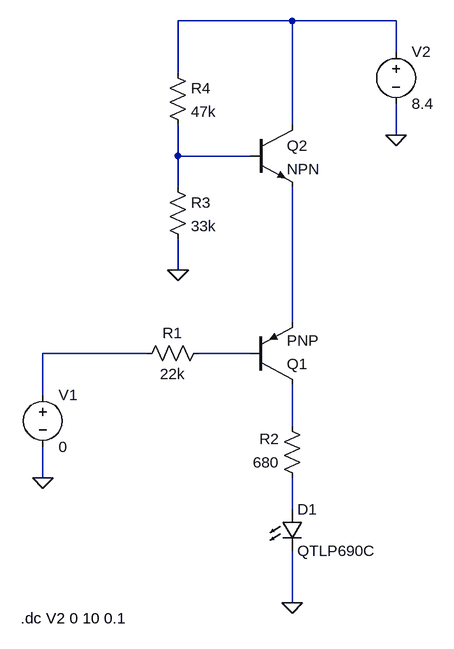
[diagram p0: schematic Compact LED.asc]
Compact LED.asc, the LTspice schematic file:
Version 4
SHEET 1 880 680
WIRE 336 -416 160 -416
WIRE 496 -416 336 -416
WIRE 496 -368 496 -416
WIRE 160 -336 160 -416
WIRE 336 -256 336 -416
WIRE 496 -240 496 -288
WIRE 160 -208 160 -256
WIRE 272 -208 160 -208
WIRE 160 -160 160 -208
WIRE 160 -32 160 -80
WIRE 336 48 336 -160
WIRE 112 96 -48 96
WIRE 272 96 192 96
WIRE -48 160 -48 96
WIRE 336 208 336 144
WIRE -48 288 -48 240
WIRE 336 336 336 288
WIRE 336 480 336 400
FLAG 336 480 0
FLAG 496 -240 0
FLAG -48 288 0
FLAG 160 -32 0
SYMBOL voltage -48 144 R0
WINDOW 123 0 0 Left 2
WINDOW 39 0 0 Left 2
SYMATTR InstName V1
SYMATTR Value 0
SYMBOL pnp 272 144 M180
SYMATTR InstName Q1
SYMBOL npn 272 -256 R0
SYMATTR InstName Q2
SYMBOL LED 320 336 R0
SYMATTR InstName D1
SYMATTR Value QTLP690C
SYMBOL res 208 80 R90
WINDOW 0 0 56 VBottom 2
WINDOW 3 32 56 VTop 2
SYMATTR InstName R1
SYMATTR Value 22k
SYMBOL res 352 304 R180
WINDOW 0 36 76 Left 2
WINDOW 3 36 40 Left 2
SYMATTR InstName R2
SYMATTR Value 680
SYMBOL res 144 -176 R0
SYMATTR InstName R3
SYMATTR Value 33k
SYMBOL res 144 -352 R0
SYMATTR InstName R4
SYMATTR Value 47k
SYMBOL voltage 496 -384 R0
WINDOW 123 0 0 Left 2
WINDOW 39 0 0 Left 2
SYMATTR InstName V2
SYMATTR Value 8.4
TEXT -82 504 Left 2 !.dc V2 0 10 0.1

The netlist it stands for:
* Compact LED.asc
V1 N004 0 0
Q1 N006 N005 N003 0 PNP
Q2 N001 N002 N003 0 NPN
D1 N007 0 QTLP690C
R1 N005 N004 22k
R2 N007 N006 680
R3 N002 0 33k
R4 N001 N002 47k
V2 N001 0 8.4
.model D D
.lib standard.dio
.model NPN NPN
.model PNP PNP
.lib standard.bjt
.dc V2 0 10 0.1
.backanno
.end